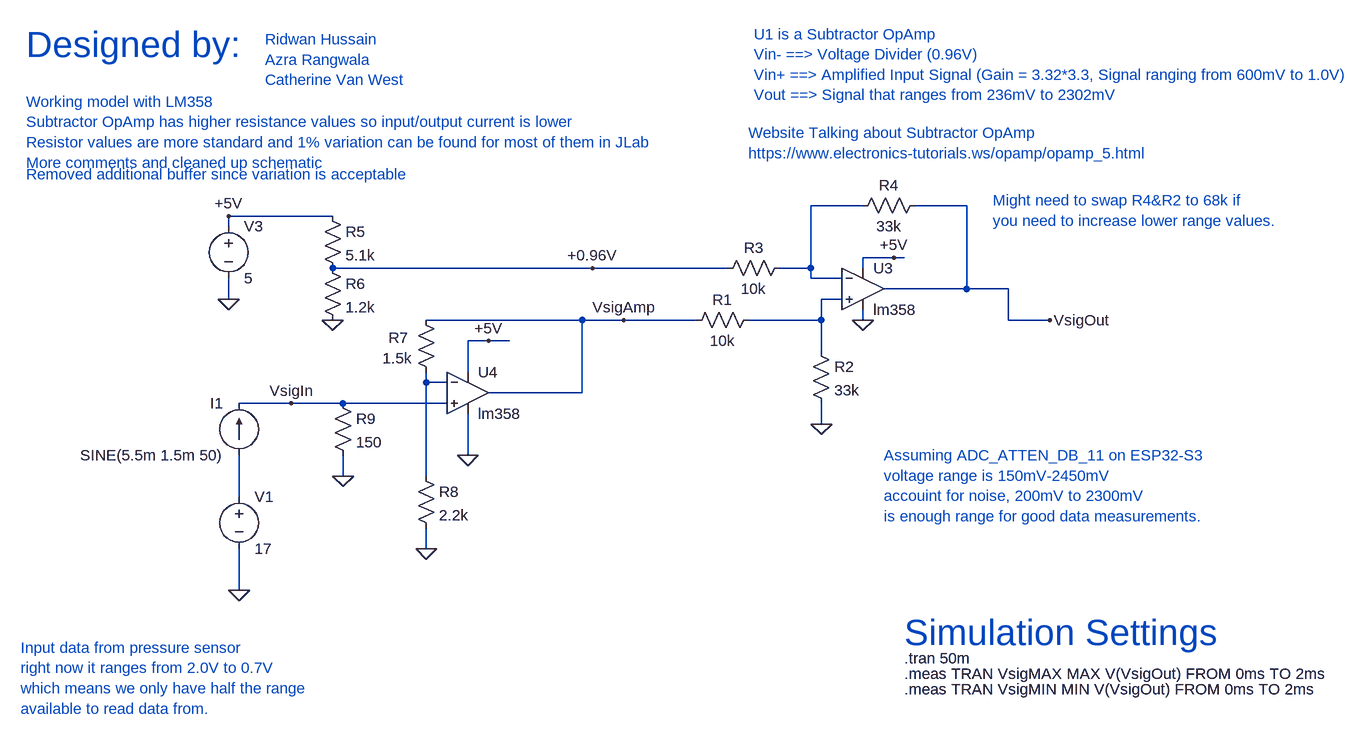
[diagram p0: schematic ADC_DC_Offset_Pressure_Sensor.asc]
ADC_DC_Offset_Pressure_Sensor.asc, the LTspice schematic file:
Version 4
SHEET 1 2400 772
WIRE 1040 -32 960 -32
WIRE 1200 -32 1120 -32
WIRE 224 -16 64 -16
WIRE 64 0 64 -16
WIRE 1088 48 1040 48
WIRE 1104 48 1088 48
WIRE 624 64 224 64
WIRE 832 64 624 64
WIRE 960 64 960 -32
WIRE 960 64 912 64
WIRE 1040 64 1040 48
WIRE 960 80 960 64
WIRE 1008 80 960 80
WIRE 1200 96 1200 -32
WIRE 1200 96 1072 96
WIRE 1264 96 1200 96
WIRE 64 112 64 80
WIRE 1008 112 976 112
WIRE 608 144 368 144
WIRE 672 144 608 144
WIRE 784 144 672 144
WIRE 976 144 976 112
WIRE 976 144 864 144
WIRE 1040 144 1040 128
WIRE 1264 144 1264 96
WIRE 1328 144 1264 144
WIRE 464 176 432 176
WIRE 496 176 464 176
WIRE 976 192 976 144
WIRE 432 224 432 176
WIRE 368 240 368 224
WIRE 400 240 368 240
WIRE 608 256 608 144
WIRE 608 256 464 256
WIRE 160 272 80 272
WIRE 240 272 160 272
WIRE 400 272 240 272
WIRE 976 304 976 272
WIRE 432 352 432 288
WIRE 240 384 240 352
WIRE 368 384 368 240
WIRE 80 416 80 352
WIRE 368 496 368 464
WIRE 80 560 80 496
FLAG 1328 144 VsigOut
FLAG 976 304 0
FLAG 64 112 0
FLAG 64 -16 +5V
FLAG 160 272 VsigIn
FLAG 224 144 0
FLAG 432 352 0
FLAG 464 176 +5V
FLAG 368 496 0
FLAG 624 64 +0.96V
FLAG 672 144 VsigAmp
FLAG 240 384 0
FLAG 80 560 0
FLAG 1088 48 +5V
FLAG 1040 144 0
SYMBOL res 880 128 R90
WINDOW 0 0 56 VBottom 2
WINDOW 3 32 56 VTop 2
SYMATTR InstName R1
SYMATTR Value 10k
SYMBOL voltage 64 -16 R0
WINDOW 123 0 0 Left 0
WINDOW 39 0 0 Left 0
SYMATTR InstName V3
SYMATTR Value 5
SYMBOL res 960 176 R0
SYMATTR InstName R2
SYMATTR Value 33k
SYMBOL res 208 -32 R0
SYMATTR InstName R5
SYMATTR Value 5.1k
SYMBOL res 208 48 R0
SYMATTR InstName R6
SYMATTR Value 1.2k
SYMBOL res 352 128 R0
WINDOW 0 -42 43 Left 2
WINDOW 3 -51 75 Left 2
SYMATTR InstName R7
SYMATTR Value 1.5k
SYMBOL res 352 368 R0
SYMATTR InstName R8
SYMATTR Value 2.2k
SYMBOL lm358 1040 32 R0
SYMATTR InstName U3
SYMBOL lm358 432 192 R0
SYMATTR InstName U4
SYMBOL res 928 48 R90
WINDOW 0 0 56 VBottom 2
WINDOW 3 32 56 VTop 2
SYMATTR InstName R3
SYMATTR Value 10k
SYMBOL res 1136 -48 R90
WINDOW 0 0 56 VBottom 2
WINDOW 3 32 56 VTop 2
SYMATTR InstName R4
SYMATTR Value 33k
SYMBOL res 224 256 R0
SYMATTR InstName R9
SYMATTR Value 150
SYMBOL current 80 352 R180
WINDOW 0 24 80 Left 2
WINDOW 3 24 0 Left 2
WINDOW 123 0 0 Left 0
WINDOW 39 0 0 Left 0
SYMATTR InstName I1
SYMATTR Value SINE(5.5m 1.5m 50)
SYMBOL voltage 80 400 R0
WINDOW 123 0 0 Left 0
WINDOW 39 0 0 Left 0
SYMATTR InstName V1
SYMATTR Value 17
TEXT 1104 664 Left 2 !.tran 50m
TEXT 864 -144 Left 2 ;Website Talking about Subtractor OpAmp\nhttps://www.electronics-tutorials.ws/opamp/opamp_5.html
TEXT 872 -296 Left 2 ;U1 is a Subtractor OpAmp\nVin- ==> Voltage Divider (0.96V)\nVin+ ==> Amplified Input Signal (Gain = 3.32*3.3, Signal ranging from 600mV to 1.0V)\nVout ==> Signal that ranges from 236mV to 2302mV
TEXT 1072 352 Left 2 ;Assuming ADC_ATTEN_DB_11 on ESP32-S3\nvoltage range is 150mV-2450mV\naccouint for noise, 200mV to 2300mV\nis enough range for good data measurements.
TEXT -256 648 Left 2 ;Input data from pressure sensor\nright now it ranges from 2.0V to 0.7V\nwhich means we only have half the range \navailable to read data from.
TEXT 120 -288 Left 2 ;Ridwan Hussain\nAzra Rangwala\nCatherine Van West
TEXT -248 -192 Left 2 ;Working model with LM358\nSubtractor OpAmp has higher resistance values so input/output current is lower\nResistor values are more standard and 1% variation can be found for most of them in JLab\nMore comments and cleaned up schematic
TEXT 1104 688 Left 2 !.meas TRAN VsigMAX MAX V(VsigOut) FROM 0ms TO 2ms
TEXT 1104 712 Left 2 !.meas TRAN VsigMIN MIN V(VsigOut) FROM 0ms TO 2ms
TEXT -248 -80 Left 2 ;Removed additional buffer since variation is acceptable
TEXT 1240 -40 Left 2 ;Might need to swap R4&R2 to 68k if \nyou need to increase lower range values.
TEXT 1104 624 Left 5 ;Simulation Settings
TEXT -248 -280 Left 5 ;Designed by:

The netlist it stands for:
* ADC_DC_Offset_Pressure_Sensor.asc
R1 N002 VsigAmp 10k
V3 +5V 0 5
R2 N002 0 33k
R5 +5V +0.96V 5.1k
R6 +0.96V 0 1.2k
R7 VsigAmp N003 1.5k
R8 N003 0 2.2k
* U3: lm358 (symbol lm358 not available, pins judged from their places): In+=N002 In-=N001 V+=+5V V-=0 OUT=VsigOut
* U4: lm358 (symbol lm358 not available, pins judged from their places): In+=VsigIn In-=N003 V+=+5V V-=0 OUT=VsigAmp
R3 N001 +0.96V 10k
R4 VsigOut N001 33k
R9 VsigIn 0 150
I1 N004 VsigIn SINE(5.5m 1.5m 50)
V1 N004 0 17
.tran 50m
* Website Talking about Subtractor OpAmp
* https://www.electronics-tutorials.ws/opamp/opamp_5.html
* U1 is a Subtractor OpAmp
* Vin- ==> Voltage Divider (0.96V)
* Vin+ ==> Amplified Input Signal (Gain = 3.32*3.3, Signal ranging from 600mV to 1.0V)
* Vout ==> Signal that ranges from 236mV to 2302mV
* Assuming ADC_ATTEN_DB_11 on ESP32-S3
* voltage range is 150mV-2450mV
* accouint for noise, 200mV to 2300mV
* is enough range for good data measurements.
* Input data from pressure sensor
* right now it ranges from 2.0V to 0.7V
* which means we only have half the range
* available to read data from.
* Ridwan Hussain
* Azra Rangwala
* Catherine Van West
* Working model with LM358
* Subtractor OpAmp has higher resistance values so input/output current is lower
* Resistor values are more standard and 1% variation can be found for most of them in JLab
* More comments and cleaned up schematic
.meas TRAN VsigMAX MAX V(VsigOut) FROM 0ms TO 2ms
.meas TRAN VsigMIN MIN V(VsigOut) FROM 0ms TO 2ms
* Removed additional buffer since variation is acceptable
* Might need to swap R4&R2 to 68k if
* you need to increase lower range values.
* Simulation Settings
* Designed by:
.backanno
.end